# Altium schematic sheet CATS-EUROC-Sensors.SchDoc: CATS EuRoC Edition
size A4; DocumentNumber: Overview; Revision: V1.0; SheetNumber: 5; SheetTotal: 16; Author: Luca Jost; Subtitle: Sensors
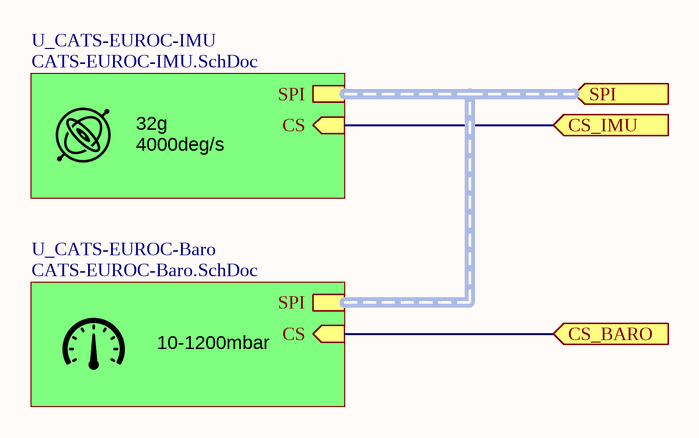
[diagram p0: CATS-EUROC-Sensors.SchDoc]

## Sub-sheets
U_CATS-EUROC-Baro = CATS-EUROC-Baro.SchDoc: SPI (harness SPI), CS (in)
U_CATS-EUROC-IMU = CATS-EUROC-IMU.SchDoc: SPI (harness SPI), CS (in)

## Ports
CS_BARO (in), CS_IMU (in), SPI (in)

## Nets
CS_BARO: port CS_BARO, sheet U_CATS-EUROC-Baro/CS
CS_IMU: port CS_IMU, sheet U_CATS-EUROC-IMU/CS

## Buses and harness runs
harness port SPI = sheet U_CATS-EUROC-Baro/SPI = sheet U_CATS-EUROC-IMU/SPI

## Notes on the sheet
- 4000deg/s
- 32g
- 10-1200mbar
- Title
- Author:
- Subtitle
- Date:
- Rev:
- File:
- Sheet
- of